# EAGLE schematic product (EAGLE 7.7.0)

## Sheet 1 of 3: MCU
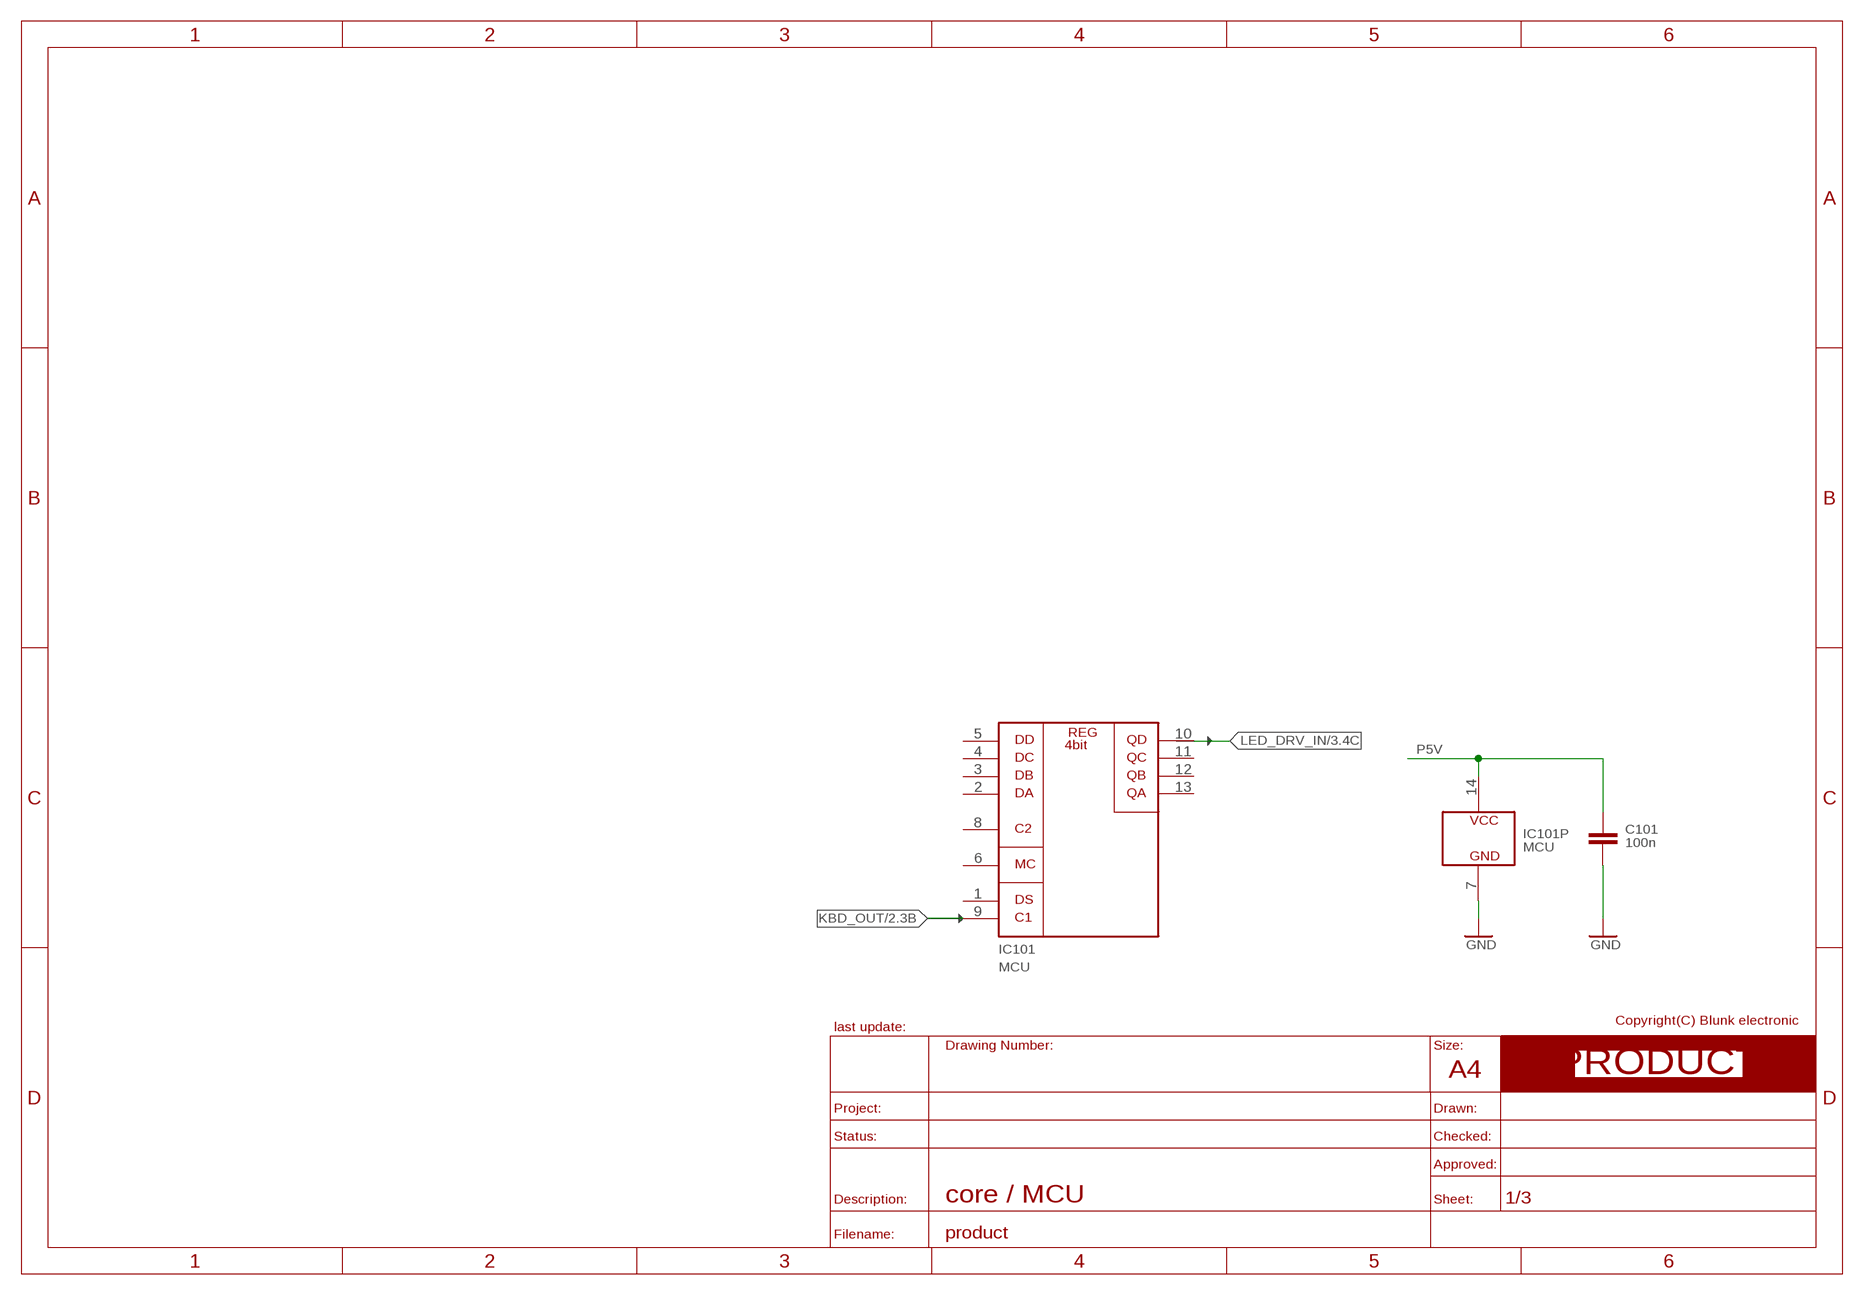
[diagram p0: schematic, sheet 1]
FRAME_PRODUCT1 (A4_LANDSCAPE_PRODUCT): BOM: NO; COMMISSIONED: 2013-08-30; DESCRIPTION: core / MCU
U$3 (ARROW_1): BOM: NO; COMMISSIONED: 2013-08-30
U$4 (ARROW_1): BOM: NO; COMMISSIONED: 2013-08-30

### Parts
C101  100n  C_S_0603  [S_0603]
IC101  MCU  7495D  [S_SO14]

### Nets
GND: C101.2 IC101.7(GND) ; also sheet 2,3
KBD_OUT: IC101.9(C1) ; also sheet 2
LED_DRV_IN: IC101.10(QD) ; also sheet 3
P5V: C101.1 IC101.14(VCC) ; also sheet 2,3
Unconnected: IC101.1(DS) IC101.2(DA) IC101.3(DB) IC101.4(DC) IC101.5(DD) IC101.6(MC) IC101.8(C2) IC101.11(QC) IC101.12(QB) IC101.13(QA)

## Sheet 2 of 3
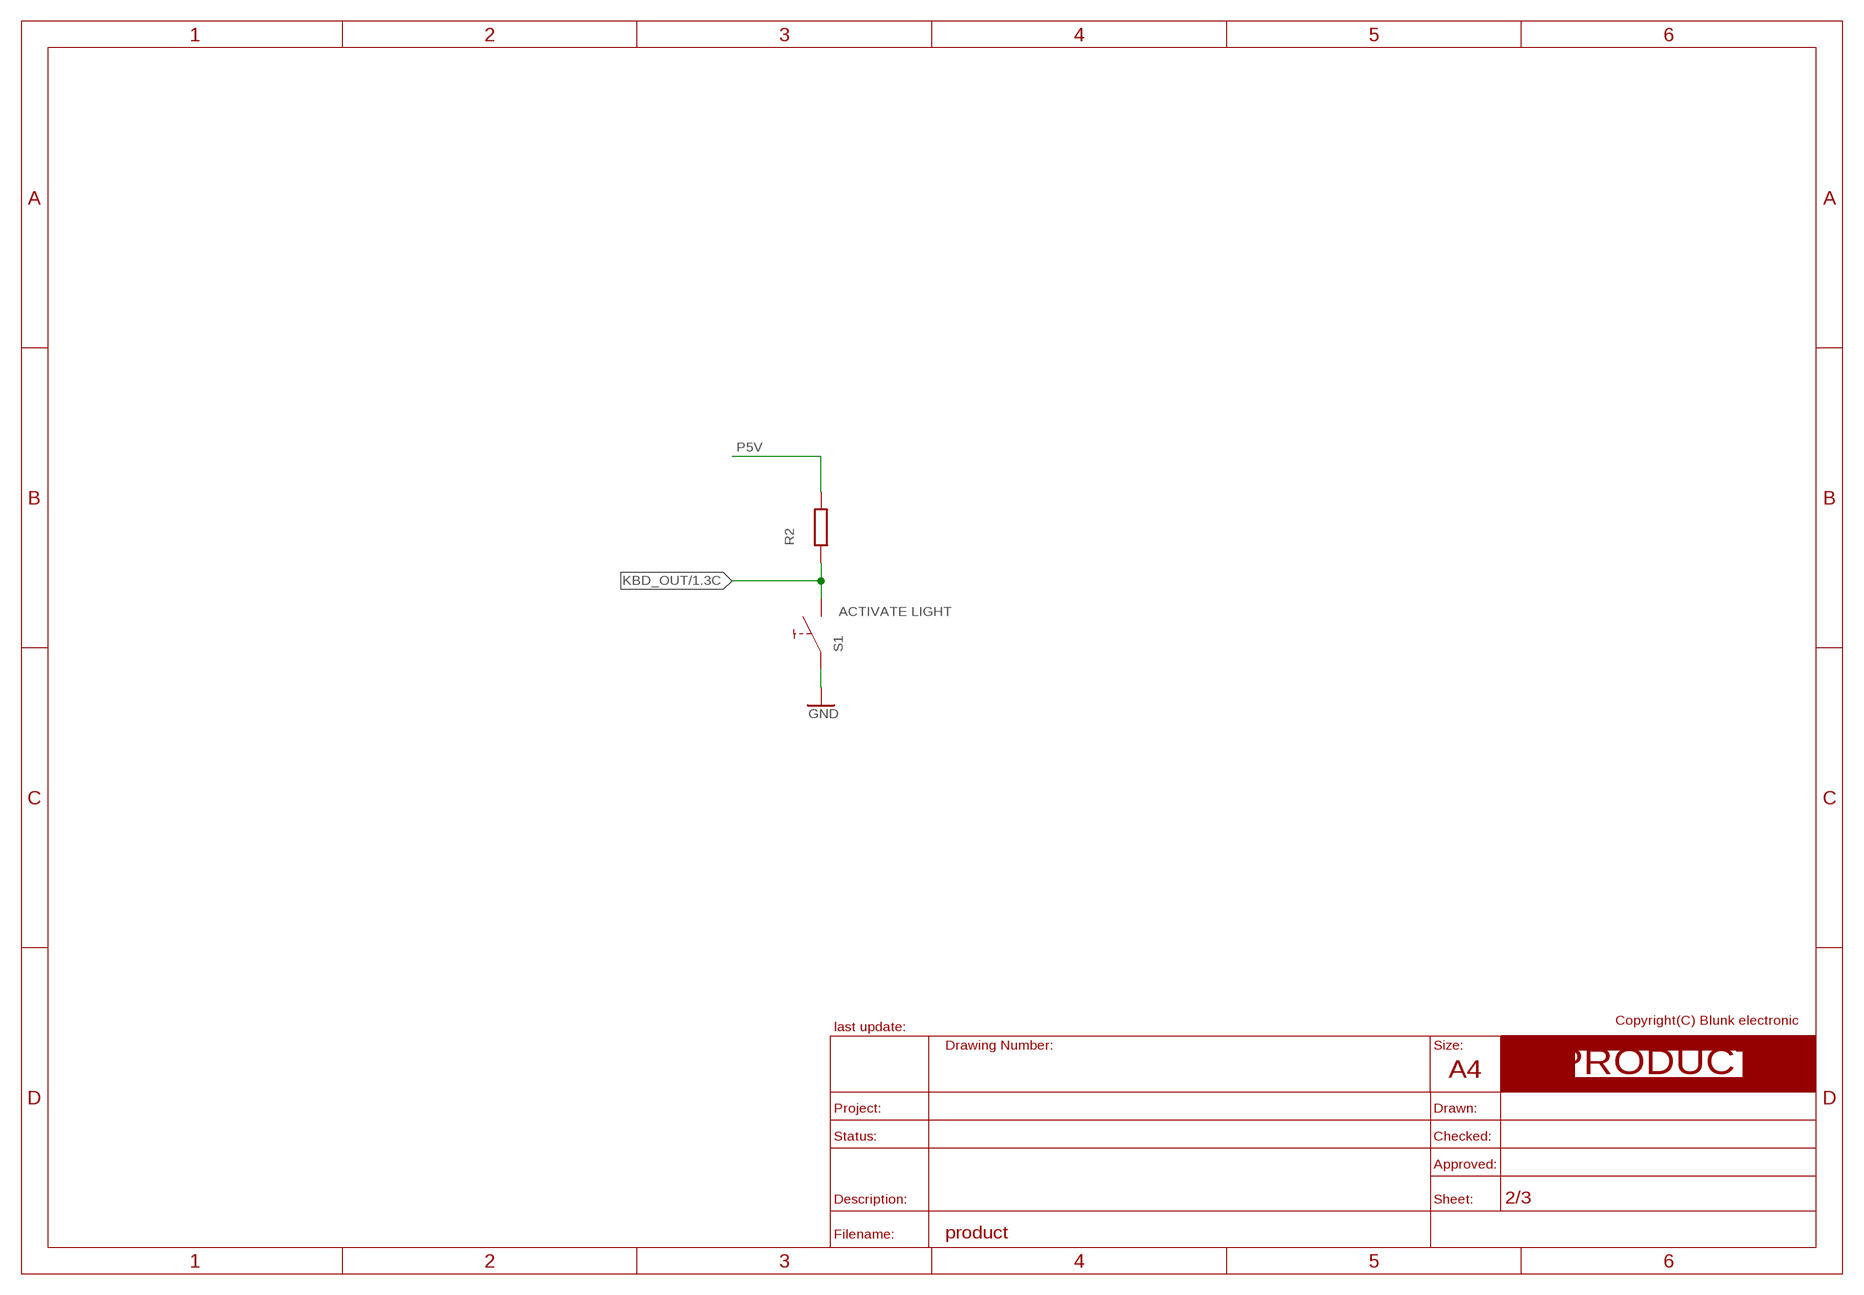
[diagram p1: schematic, sheet 2]
FRAME_PRODUCT2 (A4_LANDSCAPE_PRODUCT): BOM: NO; COMMISSIONED: 2013-08-30

### Parts
R2  R_S_0603  [S_0603]
S1  PUSH_BUTTON_S_6X6MM  [S_PUSH_BUTTON_6X6]

### Nets
GND: S1.A1 S1.A(A1) ; also sheet 1,3
KBD_OUT: R2.1 S1.B1 S1.B(B1) ; also sheet 1
P5V: R2.2 ; also sheet 1,3

## Sheet 3 of 3: led driver
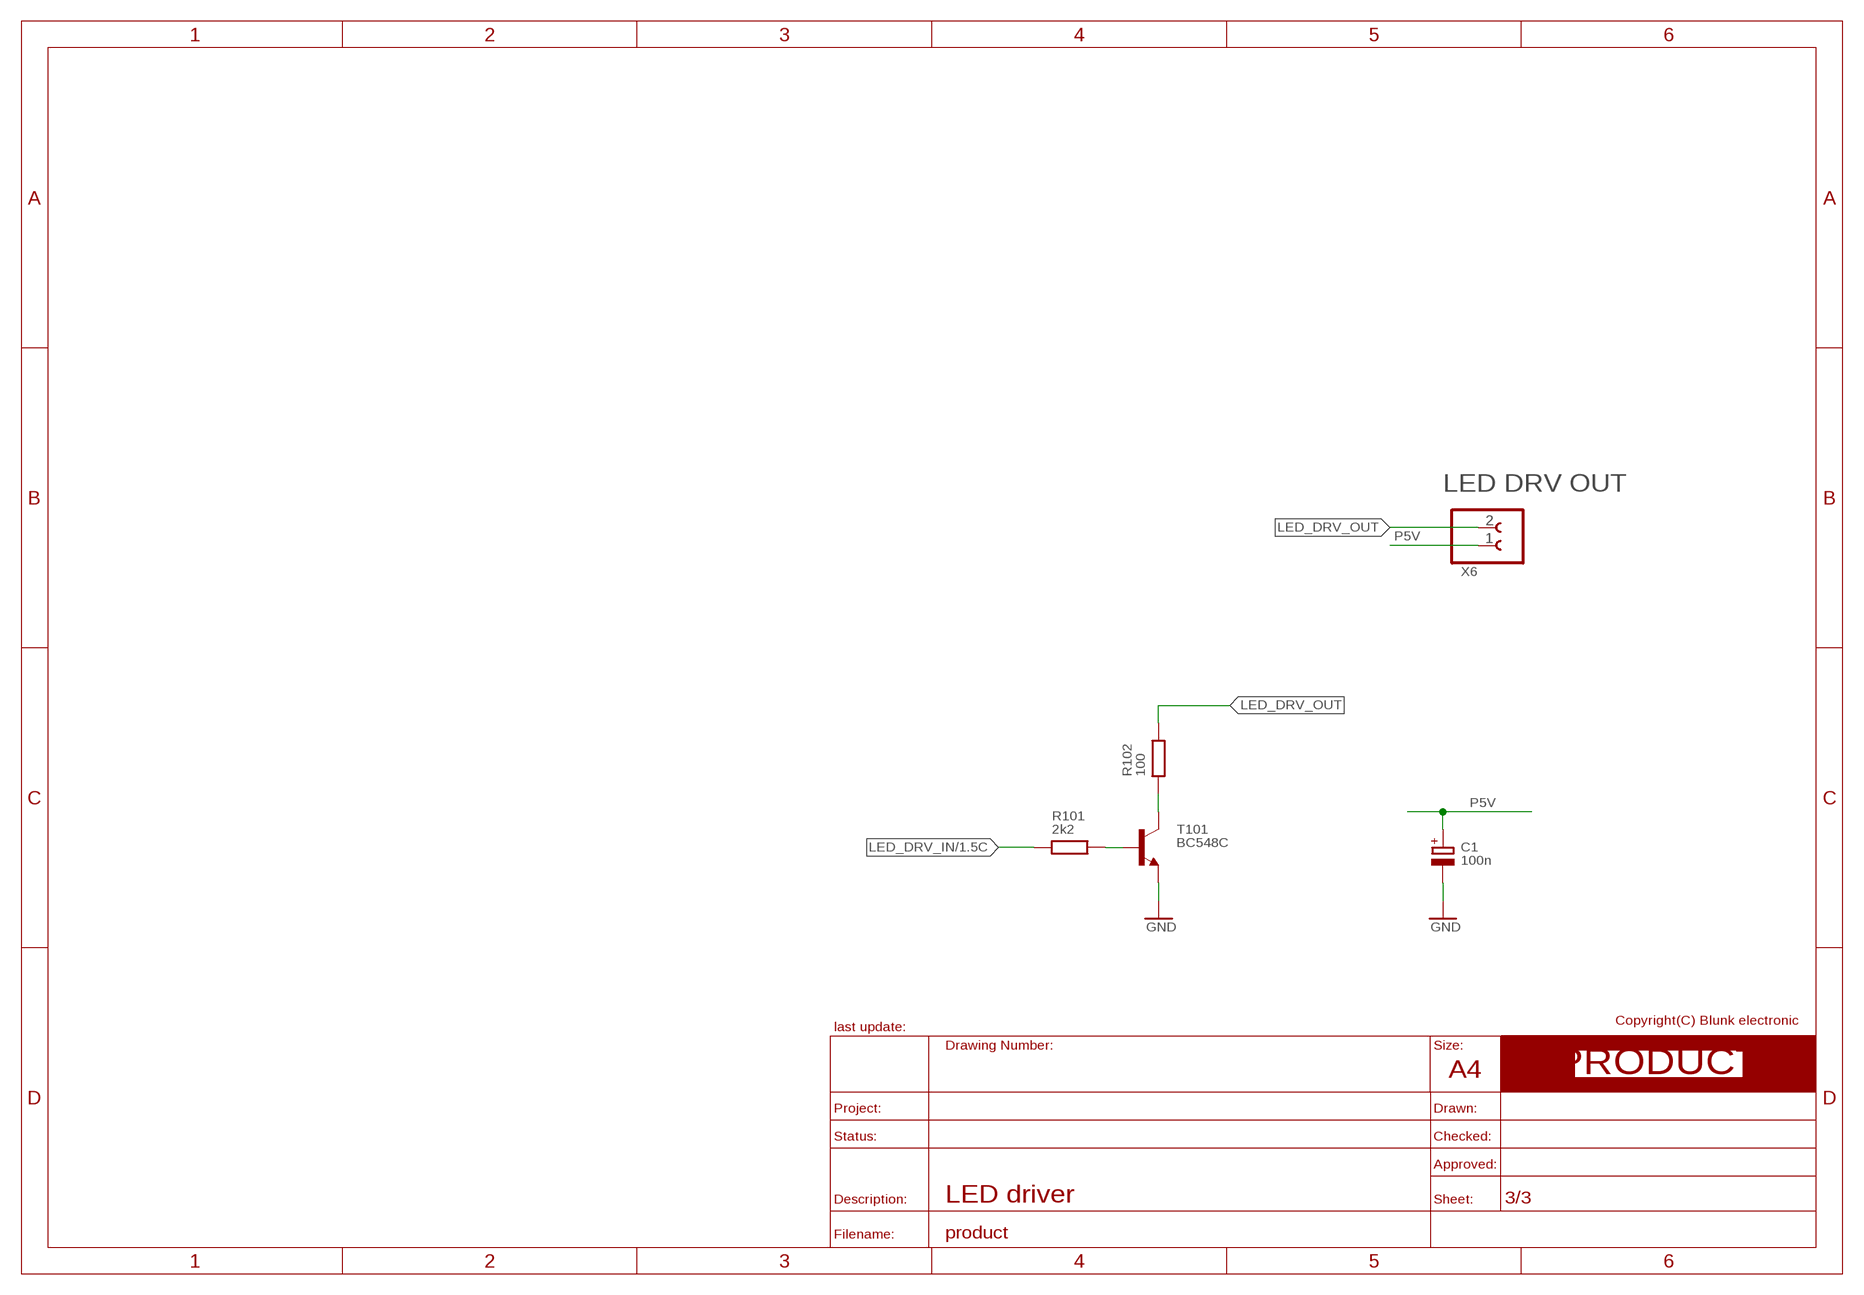
[diagram p2: schematic, sheet 3]
FRAME_PRODUCT3 (A4_LANDSCAPE_PRODUCT): BOM: NO; COMMISSIONED: 2013-08-30; DESCRIPTION: LED driver

### Parts
C1  100n  C_POL_S_3216-18  [S_3216-18]
R101  2k2  R_S_0603  [S_0603]
R102  100  R_S_0603  [S_0603]
T101  BC548C  NPN_S_SOT23  [S_SOT23]
X6  CLAMP_1X2-T-2.5MM  [T_WIRE_CLAMP_1X2_PITCH_2MM5]

### Nets
GND: C1.- T101.2(E) ; also sheet 1,2
LED_DRV_B: R101.2 T101.1(B)
LED_DRV_C: R102.1 T101.3(C)
LED_DRV_IN: R101.1 ; also sheet 1
LED_DRV_OUT: R102.2 X6.2
P5V: C1.+ X6.1 ; also sheet 1,2

## Library data of the parts
C1 = be_rcl:C_POL: edited: Mario Blunk / Blunk electronic; BOM: YES; COMMISSIONED: 2013-11-14; PART_CODE_BEL: C_PAC_S_3216-18_VAL_
C101 = be_rcl:C: drawn: Mario Blunk / Blunk electronic; BOM: YES; COMMISSIONED: 2013-08-30; PART_CODE_BEL: C_PAC_S_0603_VAL_
IC101 = be_logic:7495: edited: Mario Blunk / Blunk electronic
R2 R101 R102 = be_rcl:R: edited: Mario Blunk / Blunk electronic; BOM: YES; COMMISSIONED: 2013-08-30; PART_CODE_BEL: R_PAC_S_0603_VAL_
S1 = be_switch:PUSH_BUTTON: edited: Mario Blunk; BOM: YES; COMMISSIONED: 2013-08-30; FUNCTION: ACTIVATE LIGHT; PART_CODE_BEL: S_PAC_S_PUSH_BUTTON_6X6mm
T101 = be_transistor:NPN: edited: Mario Blunk; BOM: YES; COMMISSIONED: 2013-08-30; PART_CODE_BEL: T_PAC_S_SOT23_VAL_
X6 = be_con_jump:CLAMP_1X2: drawn: Mario Blunk / Blunk electronic; BOM: YES; COMMISSIONED: 2014-04-14; FUNCTION: LED DRV OUT; PART_CODE_BEL: X_PAC_T_CLAMP_1X2_PITCH_2mm5